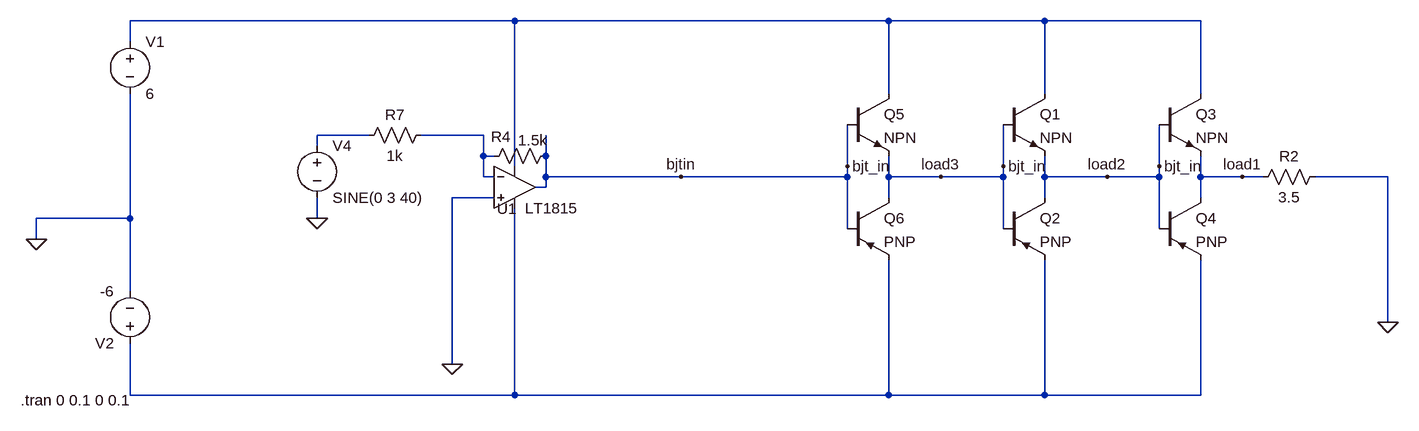
[diagram p0: schematic PowerAmp1.asc]
PowerAmp1.asc, the LTspice schematic file:
Version 4
SHEET 1 2116 824
WIRE 752 -128 160 -128
WIRE 1328 -128 752 -128
WIRE 1568 -128 1328 -128
WIRE 1808 -128 1568 -128
WIRE 160 -96 160 -128
WIRE 1328 -16 1328 -128
WIRE 1568 -16 1568 -128
WIRE 1808 -16 1808 -128
WIRE 528 48 448 48
WIRE 704 48 608 48
WIRE 448 64 448 48
WIRE 704 80 704 48
WIRE 720 80 704 80
WIRE 800 80 800 48
WIRE 752 96 752 -128
WIRE 1264 96 1264 32
WIRE 1504 96 1504 32
WIRE 1744 96 1744 32
WIRE 704 112 704 80
WIRE 720 112 704 112
WIRE 800 112 800 80
WIRE 1008 112 800 112
WIRE 1264 112 1264 96
WIRE 1264 112 1008 112
WIRE 1328 112 1328 80
WIRE 1408 112 1328 112
WIRE 1504 112 1504 96
WIRE 1504 112 1408 112
WIRE 1568 112 1568 80
WIRE 1664 112 1568 112
WIRE 1744 112 1744 96
WIRE 1744 112 1664 112
WIRE 1808 112 1808 80
WIRE 1872 112 1808 112
WIRE 1904 112 1872 112
WIRE 2096 112 1984 112
WIRE 800 128 800 112
WIRE 800 128 784 128
WIRE 720 144 656 144
WIRE 1328 144 1328 112
WIRE 1568 144 1568 112
WIRE 1808 144 1808 112
WIRE 160 176 160 -16
WIRE 160 176 16 176
WIRE 448 176 448 144
WIRE 1264 192 1264 112
WIRE 1504 192 1504 112
WIRE 1744 192 1744 112
WIRE 16 208 16 176
WIRE 160 288 160 176
WIRE 2096 336 2096 112
WIRE 656 400 656 144
WIRE 160 448 160 368
WIRE 752 448 752 160
WIRE 752 448 160 448
WIRE 1328 448 1328 240
WIRE 1328 448 752 448
WIRE 1568 448 1568 240
WIRE 1568 448 1328 448
WIRE 1808 448 1808 240
WIRE 1808 448 1568 448
FLAG 16 208 0
FLAG 656 400 0
FLAG 448 176 0
FLAG 2096 336 0
FLAG 1744 96 bjt_in
FLAG 1504 96 bjt_in
FLAG 1264 96 bjt_in
FLAG 1008 112 bjtin
FLAG 1872 112 load1
FLAG 1664 112 load2
FLAG 1408 112 load3
SYMBOL Opamps\\LT1815 752 128 R0
WINDOW 0 -27 33 Left 2
SYMATTR InstName U1
SYMBOL npn 1744 -16 R0
SYMATTR InstName Q3
SYMBOL pnp 1744 144 R0
SYMATTR InstName Q4
SYMBOL res 2000 96 R90
WINDOW 0 0 56 VBottom 2
WINDOW 3 32 56 VTop 2
SYMATTR InstName R2
SYMATTR Value 3.5
SYMBOL res 816 64 R90
WINDOW 0 2 85 VBottom 2
WINDOW 3 -24 36 VTop 2
SYMATTR InstName R4
SYMATTR Value 1.5k
SYMBOL res 624 32 R90
WINDOW 0 0 56 VBottom 2
WINDOW 3 32 56 VTop 2
SYMATTR InstName R7
SYMATTR Value 1k
SYMBOL voltage 160 -112 R0
WINDOW 123 0 0 Left 0
WINDOW 39 0 0 Left 0
SYMATTR InstName V1
SYMATTR Value 6
SYMBOL voltage 160 384 R180
WINDOW 123 0 0 Left 0
WINDOW 39 0 0 Left 0
SYMATTR InstName V2
SYMATTR Value -6
SYMBOL voltage 448 48 R0
WINDOW 123 0 0 Left 0
WINDOW 39 0 0 Left 0
SYMATTR InstName V4
SYMATTR Value SINE(0 3 40)
SYMBOL npn 1504 -16 R0
SYMATTR InstName Q1
SYMBOL pnp 1504 144 R0
SYMATTR InstName Q2
SYMBOL npn 1264 -16 R0
SYMATTR InstName Q5
SYMBOL pnp 1264 144 R0
SYMATTR InstName Q6
TEXT -8 456 Left 2 !.tran 0 0.1 0 0.1

The netlist it stands for:
* PowerAmp1.asc
* U1: LT1815 (symbol Opamps\LT1815 not available, pins judged from their places): In+=0 In-=N003 V+=N001 V-=N004 OUT=load3
Q3 N001 load3 load1 0 NPN
Q4 load1 load3 N004 0 PNP
R2 0 load1 3.5
R4 load3 N003 1.5k
R7 N003 N002 1k
V1 N001 0 6
V2 N004 0 -6
V4 N002 0 SINE(0 3 40)
Q1 N001 load3 load3 0 NPN
Q2 load3 load3 N004 0 PNP
Q5 N001 load3 load3 0 NPN
Q6 load3 load3 N004 0 PNP
.model NPN NPN
.model PNP PNP
.lib standard.bjt
.tran 0 0.1 0 0.1
.backanno
.end